# Altium project ProyectoMulticapa.PrjPcb (part 1 of 3)
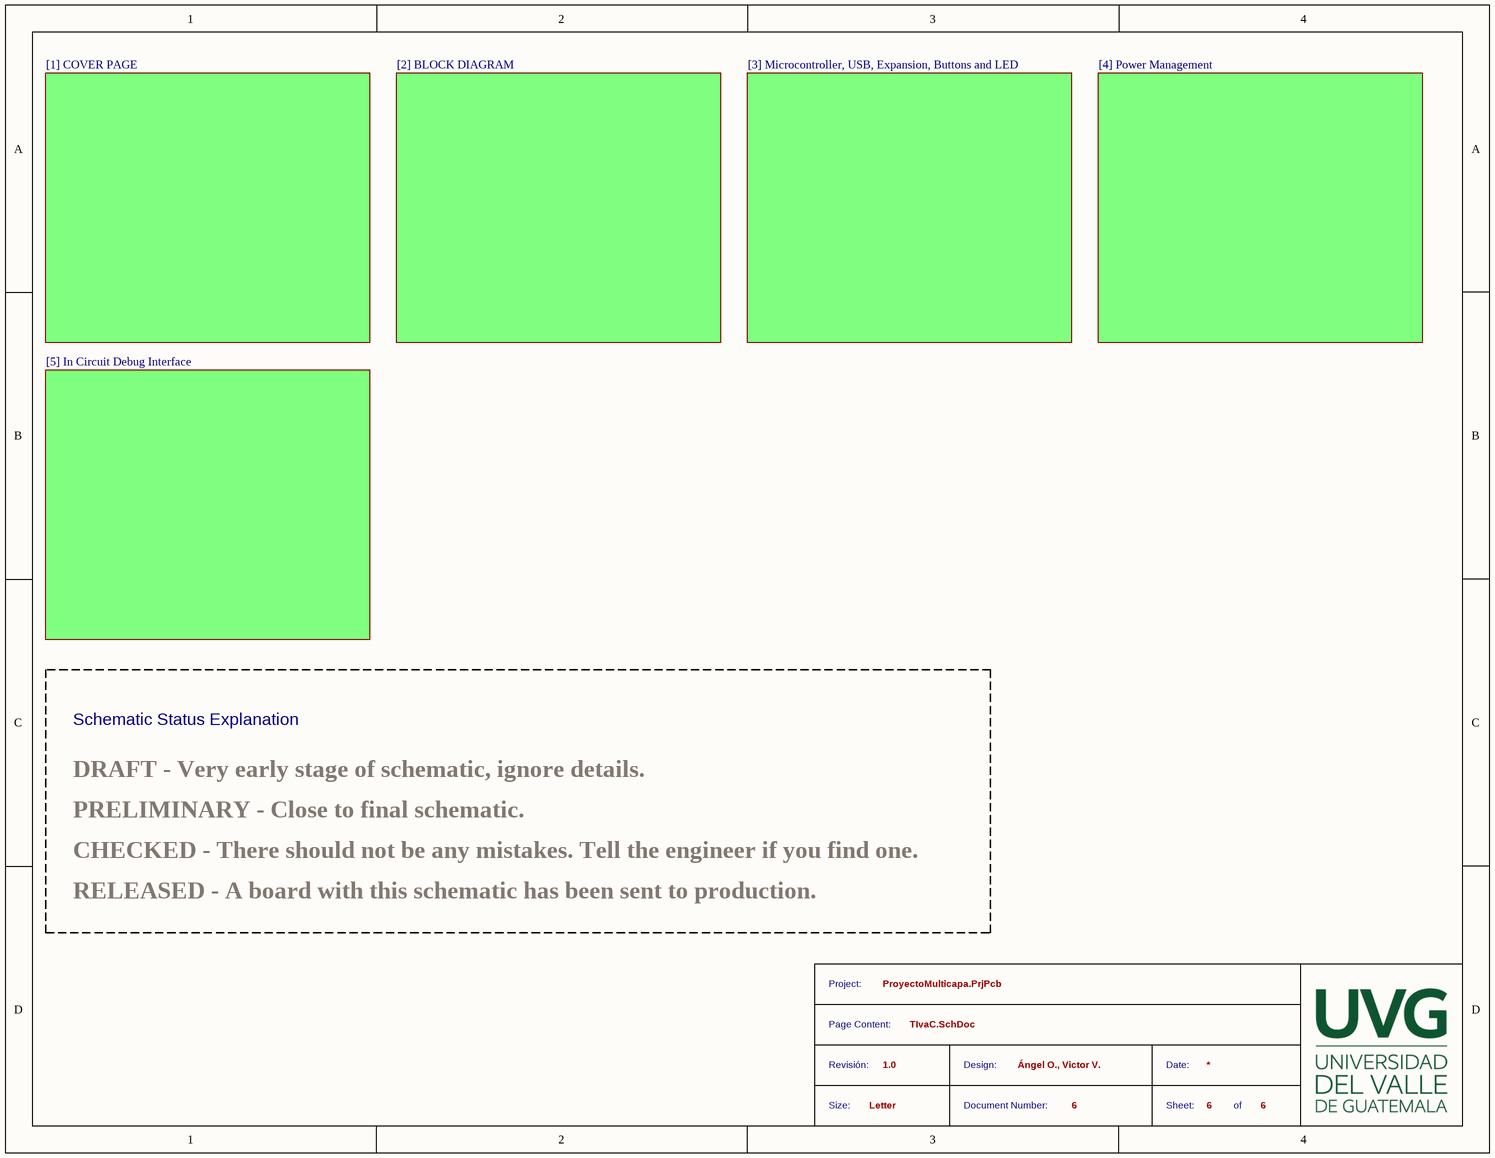
[diagram p0: TIvaC.SchDoc]
6 sheets, 98 parts. Net scope: global (net labels, ports and power ports of the same name join across sheets).
Board file: TivaC.PcbDoc
Sheets:
  TIvaC.SchDoc
    Designator = [1] COVER PAGE.SchDoc
    Designator = [2] BLOCK DIAGRAM.SchDoc
    Designator = [3] Microcontroller, USB, Expansion, Buttons and LED.SchDoc
    Designator = [4] Power Management.SchDoc
    Designator = [5] In Circuit Debug Interface.SchDoc

## Sheet TIvaC.SchDoc
size Letter; Author: Ángel O., Victor V.; DocumentNumber: 6; Revision: 1.0; SheetNumber: 6; SheetTotal: 6

### Sub-sheets
Designator = [1] COVER PAGE: no entries
Designator = [2] BLOCK DIAGRAM: no entries
Designator = [3] Microcontroller, USB, Expansion, Buttons and LED: no entries
Designator = [4] Power Management: no entries
Designator = [5] In Circuit Debug Interface: no entries

### Notes on the sheet
- Schematic Status Explanation
- PRELIMINARY - Close to final schematic.
- DRAFT - Very early stage of schematic, ignore details.
- RELEASED - A board with this schematic has been sent to production.
- CHECKED - There should not be any mistakes. Tell the engineer if you find one.
- Project:
- Page Content:
- Revisión:
- Size:
- Letter
- Design:
- Document Number:
- Date:
- Sheet:
- of

## Sheet [1] COVER PAGE.SchDoc
size Letter; Author: Ángel O. , Victor V.; DocumentNumber: 1; Revision: 1.0; SheetNumber: 1; SheetTotal: 6
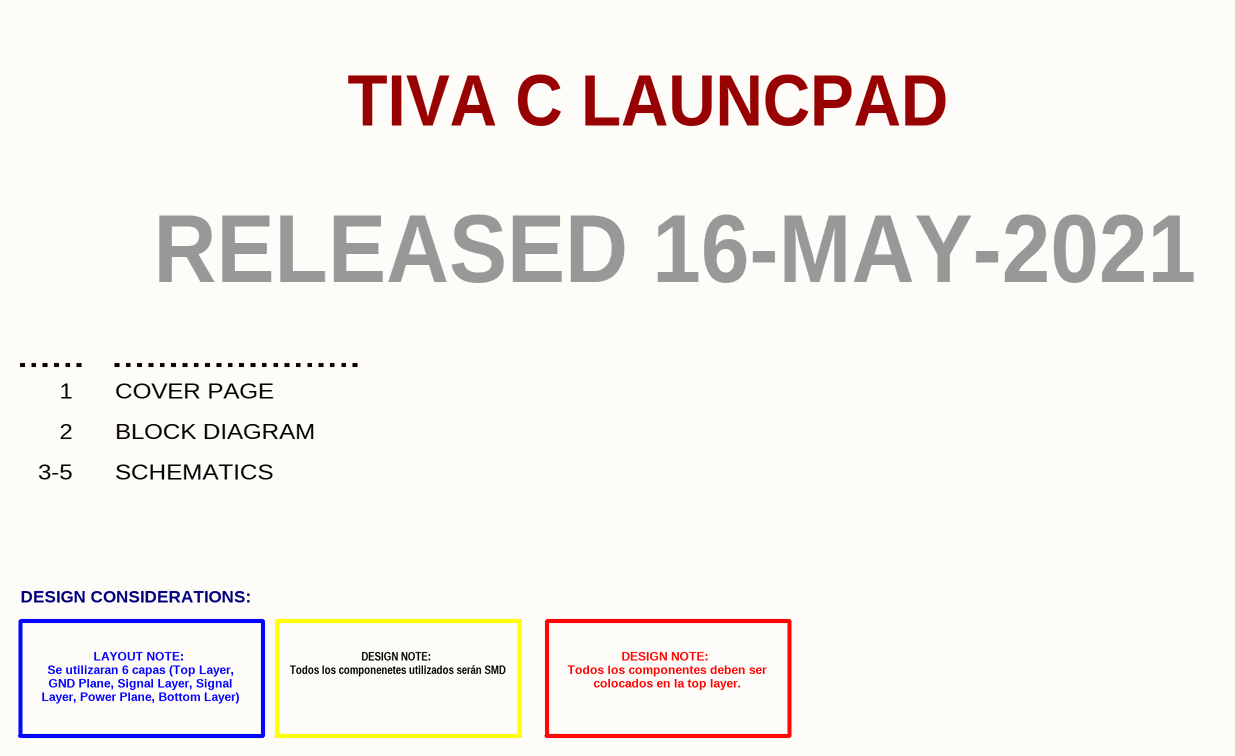
[diagram p1: [1] COVER PAGE.SchDoc]

### Notes on the sheet
- TIVA C LAUNCPAD
- RELEASED 16-MAY-2021
- 1
- COVER PAGE
- 2
- 3-5
- BLOCK DIAGRAM
- SCHEMATICS
- DESIGN CONSIDERATIONS:
- DESIGN NOTE:
  Todos los componenetes utilizados serán SMD
- DESIGN NOTE:
  Todos los componentes deben ser colocados en la top layer.
- LAYOUT NOTE:
  Se utilizaran 6 capas (Top Layer, GND Plane, Signal Layer, Signal Layer, Power Plane, Bottom Layer)
- Project:
- Page Content:
- Revisión:
- Size:
- Letter
- Design:
- Document Number:
- Date:
- Sheet:
- of

## Sheet [2] BLOCK DIAGRAM.SchDoc
size Letter; Author: Ángel O. , Victor V.; DocumentNumber: 2; Revision: 1.0; SheetNumber: 2; SheetTotal: 6
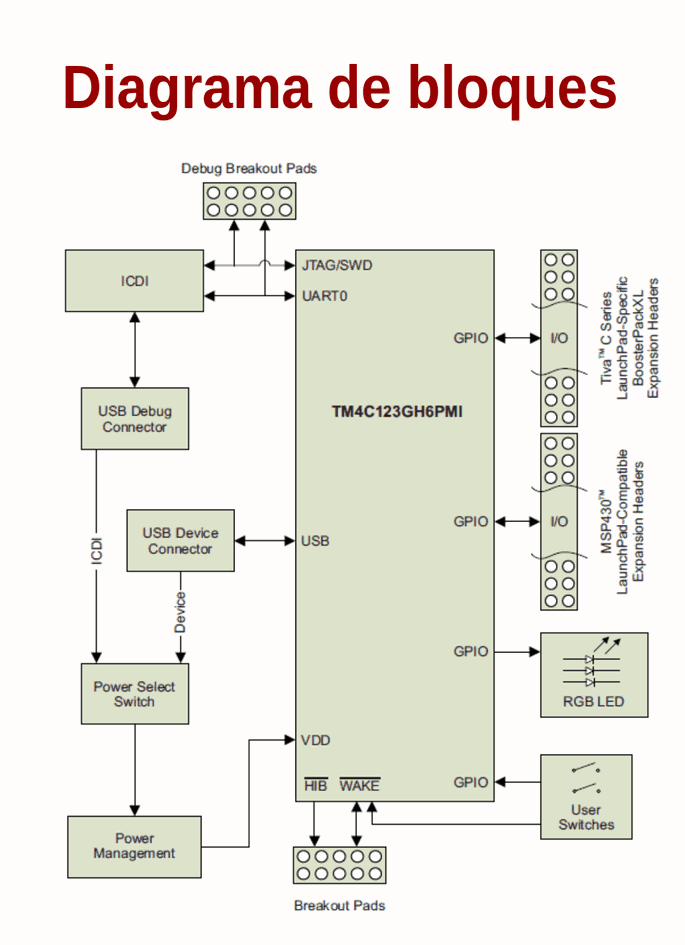
[diagram p2: [2] BLOCK DIAGRAM.SchDoc]

### Notes on the sheet
- Diagrama de bloques
- Project:
- Page Content:
- Revisión:
- Size:
- Letter
- Design:
- Document Number:
- Date:
- Sheet:
- of

## Sheet [3] Microcontroller, USB, Expansion, Buttons and LED.SchDoc
size Letter; Author: Ángel o., Victor V.; DocumentNumber: 3; Revision: 1.0; SheetNumber: 3; SheetTotal: 6
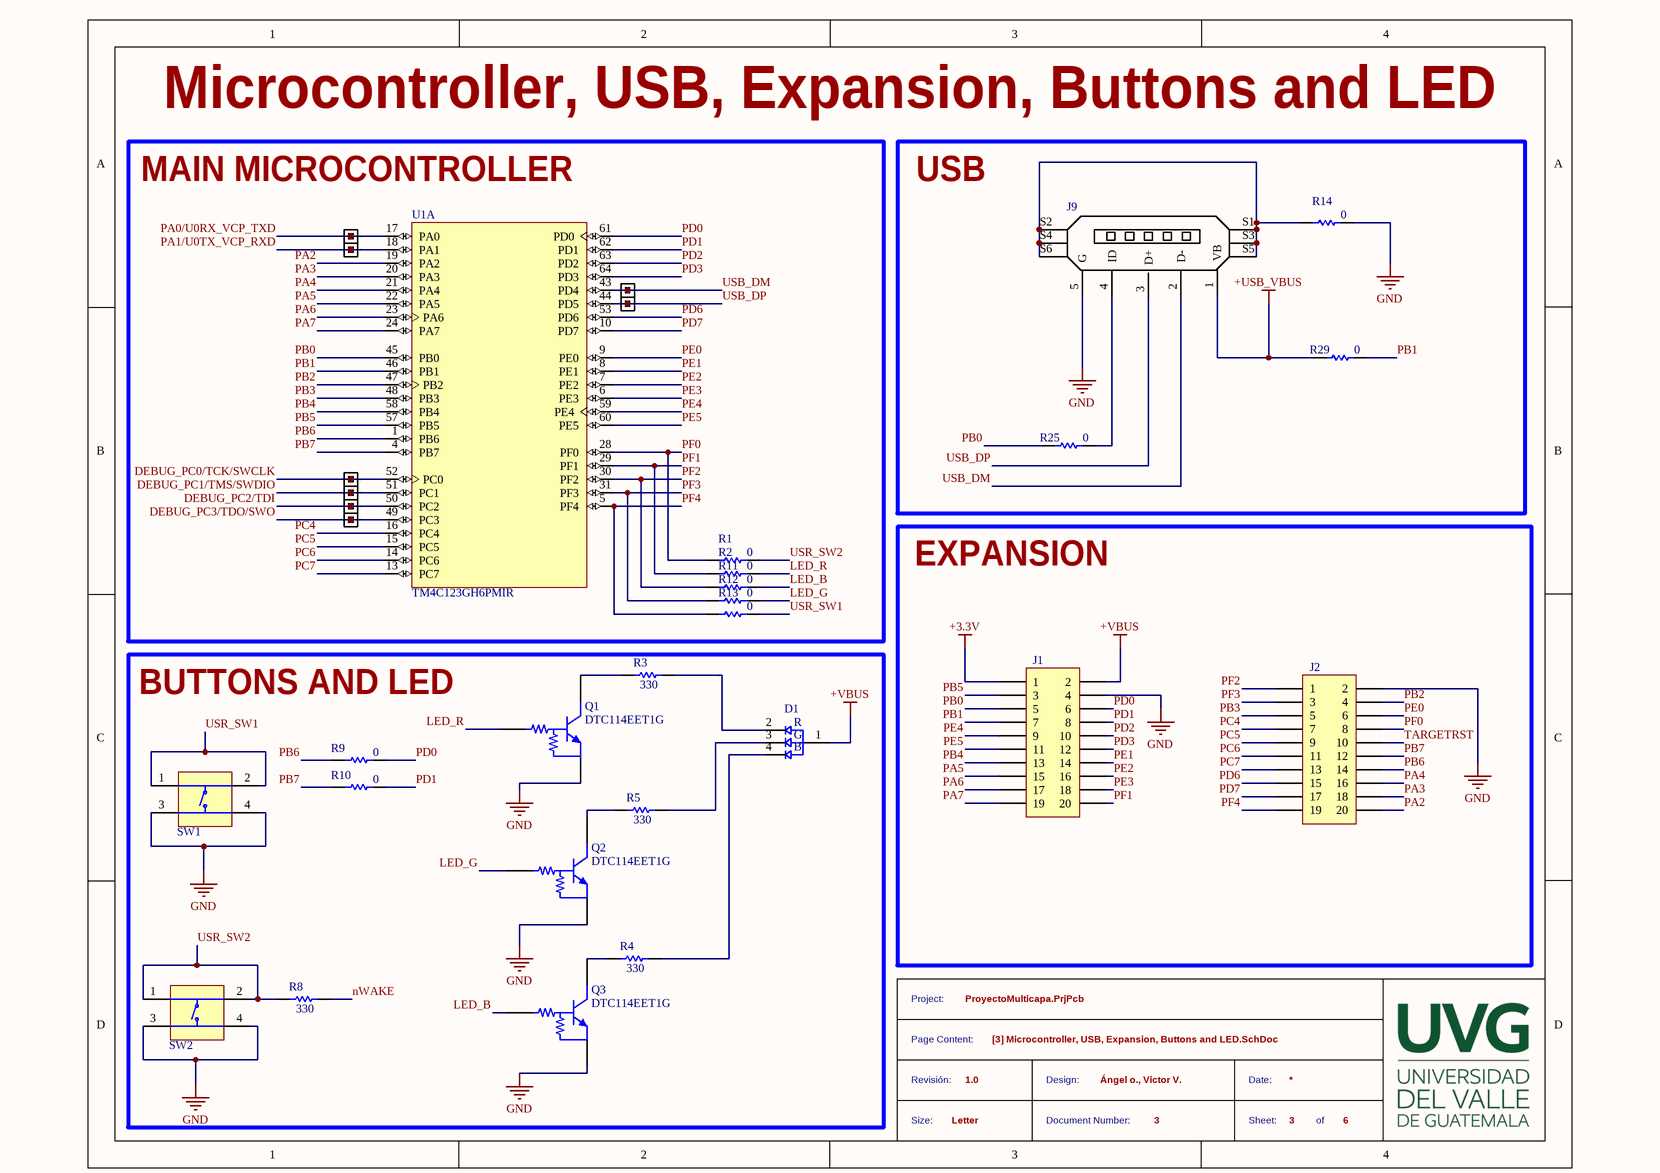
[diagram p3: [3] Microcontroller, USB, Expansion, Buttons and LED.SchDoc]

### Parts
D1  RSGHBHC1  [RGB LED]  (value not drawn)
J1  Header 20  [HDR2X10]  (value not drawn)
J2  Header 20  [HDR2X10]  (value not drawn)
J9  ZX62-B-5PA  [ZX62B5PA]  (value not drawn)
P1  header  [HEADER 1]  (value not drawn)
P2  header  [HEADER 1]  (value not drawn)
P3  header  [HEADER 1]  (value not drawn)
P4  header  [HEADER 1]  (value not drawn)
P5  header  [HEADER 1]  (value not drawn)
P6  header  [HEADER 1]  (value not drawn)
P7  header  [HEADER 1]  (value not drawn)
P8  header  [HEADER 1]  (value not drawn)
Q1  DTC114EET1G  [ONSC-SC-75-3-463-01_V]
Q2  DTC114EET1G  [ONSC-SC-75-3-463-01_V]
Q3  DTC114EET1G  [ONSC-SC-75-3-463-01_V]
R1  ERJ-3GEY0R00V  [FP-ERJ-3GEY0R00V-IPC_A]  (value not drawn)
R2  ERJ-3GEY0R00V  [FP-ERJ-3GEY0R00V-IPC_A]  (value not drawn)
R3  RC0402FR-07330RL  [RESC1005X40X25LL05T10]  (value not drawn)
R4  RC0402FR-07330RL  [RESC1005X40X25LL05T10]  (value not drawn)
R5  RC0402FR-07330RL  [RESC1005X40X25LL05T10]  (value not drawn)
R8  RC0402FR-07330RL  [RESC1005X40X25LL05T10]  (value not drawn)
R9  ERJ-3GEY0R00V  [FP-ERJ-3GEY0R00V-IPC_A]  (value not drawn)
R10  ERJ-3GEY0R00V  [FP-ERJ-3GEY0R00V-IPC_A]  (value not drawn)
R11  ERJ-3GEY0R00V  [FP-ERJ-3GEY0R00V-IPC_A]  (value not drawn)
R12  ERJ-3GEY0R00V  [FP-ERJ-3GEY0R00V-IPC_A]  (value not drawn)
R13  ERJ-3GEY0R00V  [FP-ERJ-3GEY0R00V-IPC_A]  (value not drawn)
R14  ERJ-3GEY0R00V  [FP-ERJ-3GEY0R00V-IPC_A]  (value not drawn)
R25  ERJ-3GEY0R00V  [FP-ERJ-3GEY0R00V-IPC_A]  (value not drawn)
R29  ERJ-3GEY0R00V  [FP-ERJ-3GEY0R00V-IPC_A]  (value not drawn)
SW1  B3S-1000  [OMRON-B3S-1000-4_V]  (value not drawn)
SW2  B3S-1000  [OMRON-B3S-1000-4_V]  (value not drawn)
U1  TM4C123GH6PMIR  [PM0064A_L]  (part A of 3)

### Blocks framed on the sheet
MAIN MICROCONTROLLER: P1-P8 R1 R2 R11-R13 U1
USB: J9 R14 R25 R29
EXPANSION: J1 J2
BUTTONS AND LED: D1 Q1-Q3 R3-R5 R8-R10 SW1 SW2

### Nets
+3.3V: J1.1
+USB_VBUS: J9.1(VB) R29.1
+VBUS: D1.1(A) J1.2
GND: J1.4 J2.2 J9.5(G) Q1.2(E) Q2.2(E) Q3.2(E) R14.2 SW1.3 SW1.4 SW2.3 SW2.4
DEBUG_PC0/TCK/SWCLK: P3.1 U1.52(PC0)
DEBUG_PC1/TMS/SWDIO: P4.1 U1.51(PC1)
DEBUG_PC2/TDI: P5.1 U1.50(PC2)
DEBUG_PC3/TDO/SWO: P6.1 U1.49(PC3)
LED_B: Q3.1(B) R11.2
LED_G: Q2.1(B) R12.2
LED_R: Q1.1(B) R2.2
nWAKE: R8.2
PA0/U0RX_VCP_TXD: P1.1 U1.17(PA0)
PA1/U0TX_VCP_RXD: P2.1 U1.18(PA1)
PA2: J2.20 U1.19(PA2)
PA3: J2.18 U1.20(PA3)
PA4: J2.16 U1.21(PA4)
PA5: J1.15 U1.22(PA5)
PA6: J1.17 U1.23(PA6)
PA7: J1.19 U1.24(PA7)
PB0: J1.5 R25.1 U1.45(PB0)
PB1: J1.7 R29.2 U1.46(PB1)
PB2: J2.4 U1.47(PB2)
PB3: J2.5 U1.48(PB3)
PB4: J1.13 U1.58(PB4)
PB5: J1.3 U1.57(PB5)
PB6: J2.14 R9.1 U1.1(PB6)
PB7: J2.12 R10.1 U1.4(PB7)
PC4: J2.7 U1.16(PC4)
PC5: J2.9 U1.15(PC5)
PC6: J2.11 U1.14(PC6)
PC7: J2.13 U1.13(PC7)
PD0: J1.6 R9.2 U1.61(PD0)
PD1: J1.8 R10.2 U1.62(PD1)
PD2: J1.10 U1.63(PD2)
PD3: J1.12 U1.64(PD3)
PD6: J2.15 U1.53(PD6)
PD7: J2.17 U1.10(PD7)
PE0: J2.6 U1.9(PE0)
PE1: J1.14 U1.8(PE1)
PE2: J1.16 U1.7(PE2)
PE3: J1.18 U1.6(PE3)
PE4: J1.9 U1.59(PE4)
PE5: J1.11 U1.60(PE5)
PF0: J2.8 R1.1 U1.28(PF0)
PF1: J1.20 R2.1 U1.29(PF1)
PF2: J2.1 R11.1 U1.30(PF2)
PF3: J2.3 R12.1 U1.31(PF3)
PF4: J2.19 R13.1 U1.5(PF4)
TARGETRST: J2.10
USB_DM: J9.2(D-) P7.1 U1.43(PD4)
USB_DP: J9.3(D+) P8.1 U1.44(PD5)
USR_SW1: R13.2 SW1.1 SW1.2
USR_SW2: R1.2 R8.1 SW2.1 SW2.2
NetD1_2: D1.2(R) R3.2
NetD1_3: D1.3(G) R5.2
NetD1_4: D1.4(B) R4.2
NetJ9_4: J9.4(ID) R25.2
NetJ9_S1: J9.S1 J9.S2 J9.S3 J9.S4 J9.S5 J9.S6 R14.1
NetQ1_3: Q1.3(C) R3.1
NetQ2_3: Q2.3(C) R5.1
NetQ3_3: Q3.3(C) R4.1

### Notes on the sheet
- Microcontroller, USB, Expansion, Buttons and LED
- Project:
- Page Content:
- Revisión:
- Size:
- Letter
- Design:
- Document Number:
- Date:
- Sheet:
- of
- (in symbol ERJ-3GEY0R00V) 0
- (in symbol RC0402FR-07330RL) 330

### Library data of the parts
D1 = RSGHBHC1: RGB LED; Manufacturer_Name: ROHM Semiconductor; Manufacturer_Part_Number: SMLP34RGB2W3; Manufacturer: Everlight; Manufacturer Part Number: 18-038/RSGHBHC1-S03/2T; Color: Blue,Green,Red; Lens Style: Clear; Forward Voltage: 3.3V; Datasheet Link: https://datasheet.lcsc.com/lcsc/1811021521_Everlight-Elec-18-038BT-BDGAR6S1-S06-10T_C142314.pdf; Height: 0.25mm; Mouser Part Number: 755-SMLP34RGB2W3; LCSC Price/Stock: https://lcsc.com/product-detail/Light-Emitting-Diodes-LED_RGB_C142314.html; RS Part Number: 1246883P; Price: 0.08; Supplier 1: Avnet; Stock 1: 0; RoHS: No; Lead Free: Lead Free; ComponentLink1URL: http://www.everlight.com/datasheets/18-038-RSGHBHC1-S01-2T.pdf?src-supplier=Avnet; ComponentLink1Description: http://www.everlight.com/datasheets/18-038-RSGHBHC1-S01-2T.pdf?src-supplier=Avnet; Supplier Part Number 1: 18-038/RSGHBHC1-S03-2T; RoHS Compliant: Yes
J1 J2 = SSW-110-23-S-D: Conn Socket Strip SKT 20 POS 2.54mm Solder ST Thru-Hole; Manufacturer: Samtec; Number of Contacts: 20; Gender: Female; Supplier 1: Mouser; Manufacturer Part Number: SSW-110-23-S-D; Stock 1: 82; Pricing 1: 1 = 5.20000, 10 = 4.99000, 50 = 4.99000, 100 = 4.16000, 1000 = 3.01000, 10000 = 2.76000 (USD); RoHS: Yes; Mount: Through Hole; Contact Plating: Gold; Number of Rows: 2; Packaging: Bulk; Termination: Solder; Pitch: 2.54mm; Radiation Hardening: No; RoHS Compliant: Yes; ComponentLink1URL: ftp://ftp.samtec.com/webfiles/PDF/SSQ_TH.PDF?src-supplier=Avnet; ComponentLink1Description: ftp://ftp.samtec.com/webfiles/PDF/SSQ_TH.PDF?src-supplier=Avnet
J9 = ZX62-B-5PA: USB Connectors MICRO B RECEPT RA SMT BTTM MNT; Manufacturer: Hirose; Manufacturer Part Number: ZX62-B-5PA(11); Number of Terminals/Pins: 5; Connector Type: USB,Receptacle; Gender: Receptacle; Current Rating: 1A; Mating Cycles: 10000; Voltage Rating: 30V; Number of Ports: 1; USB Standard: USB 2.0; Pitch: 0.65mm; Supplier 1: Farnell; Stock 1: 0; Pricing 1: 10 = 0.60800, 50 = 0.48000, 100 = 0.44900, 250 = 0.43000, 500 = 0.39100, 1000 = 0.35900 (GBP); RoHS: Yes; Mount: Surface Mount,Horizontal; Contact Plating: Gold; Contact Material: Copper Alloy; Min Operating Temperature: -30°C; Max Operating Temperature: 85°C; Packaging: Tape and Reel; Number of Contacts: 5; Package Quantity: 3500; Series: ZX62; Termination: Solder; Orientation: Right Angle; Number of Positions: 5; Max Voltage Rating (AC): 30V; Voltage Rating (AC): 30V; Length: 7.9mm; Depth: 5.6mm; Radiation Hardening: No; RoHS Compliant: Yes; REACH SVHC: No SVHC; Lead Free: Lead Free; Flammability Rating: UL94 V-0; ComponentLink1URL: https://datasheet.ciiva.com/11731/0900766b80d9c4df-11731324.pdf?src-supplier=RSComponents; ComponentLink1Description: https://datasheet.ciiva.com/11731/0900766b80d9c4df-11731324.pdf?src-supplier=RSComponents; ComponentLink2URL: https://datasheet.ciiva.com/15181/getdatasheetpartid-449685-15181366.pdf?src-supplier=Verical; ComponentLink2Description: https://datasheet.ciiva.com/15181/getdatasheetpartid-449685-15181366.pdf?src-supplier=Verical; ComponentLink3URL: https://datasheet.ciiva.com/7646/81390-7646778.pdf?src-supplier=Element14; ComponentLink3Description: https://datasheet.ciiva.com/7646/81390-7646778.pdf?src-supplier=Element14; Supplier 2: Mouser; Stock 2: 45031; Pricing 2: 1 = 0.61000, 10 = 0.57200, 50 = 0.57200, 100 = 0.46800, 1000 = 0.37700, 10000 = 0.33800 (USD); ComponentLink4URL: http://www.farnell.com/datasheets/2691174.pdf?src-supplier=Farnell; ComponentLink4Description: http://www.farnell.com/datasheets/2691174.pdf?src-supplier=Farnell; ComponentLink5URL: https://www.hirose.com/product/en/download_file/key_name/ZX62-B-5PA%2833%29/category/Specification%20Sheet/doc_file_id/87473/?file_category_id=9&item_id=02420033833&is_series=&src-supplier=Digi-Key; ComponentLink5Description: https://www.hirose.com/product/en/download_file/key_name/ZX62-B-5PA%2833%29/category/Specification%20Sheet/doc_file_id/87473/?file_category_id=9&item_id=02420033833&is_series=&src-supplier=Digi-Key; ComponentLink6URL: http://www.farnell.com/datasheets/2691174.pdf?src-supplier=Newark; ComponentLink6Description: http://www.farnell.com/datasheets/2691174.pdf?src-supplier=Newark; ComponentLink7URL: http://www.farnell.com/datasheets/2691174.pdf?src-supplier=Element14; ComponentLink7Description: http://www.farnell.com/datasheets/2691174.pdf?src-supplier=Element14; ComponentLink8URL: http://www.farnell.com/datasheets/2060515.pdf?src-supplier=Element14; ComponentLink8Description: http://www.farnell.com/datasheets/2060515.pdf?src-supplier=Element14; Supplier Part Number 1: 1645325; Supplier Part Number 2: 798-ZX62-B-5PA33
Q1-Q3 = DTC114EET1G: Trans Digital BJT NPN 50V 100mA 3-Pin SOT-416 T/R; Manufacturer: ON Semiconductor; Element Configuration: Single; hFE Min: 35; Max Power Dissipation: 200mW; Collector-emitter Voltage-Max: 250mV; Current Rating: 70mA; Output Voltage: 300mV; Supplier 1: Mouser; Manufacturer Part Number: DTC114EET1G; Stock 1: 385; Pricing 1: 1 = 0.16000, 10 = 0.14800, 50 = 0.14800, 100 = 0.08100, 1000 = 0.03400, 10000 = 0.02200 (USD); RoHS: Yes; Case/Package: SOT-416; Number of Pins: 3; Contact Plating: Tin,Matte; Min Operating Temperature: -55°C; Max Operating Temperature: 150°C; Collector Emitter Voltage (VCEO): 50V; Package Quantity: 1; Packaging: Tape and Reel; Max Collector Current: 100mA; Collector Emitter Breakdown Voltage: 50V; Polarity: NPN; Series: -; Max Output Current: 100mA; Operating Supply Voltage: 50V; Max Breakdown Voltage: 50V; Continuous Collector Current: 100mA; Collector Emitter Saturation Voltage: 250mV; Voltage Rating (DC): 50V; Length: 1.6mm; Width: 0.8mm; Height: 0.75mm; Radiation Hardening: No; RoHS Compliant: Yes; Lead Free: Lead Free; Halogen Free: Halogen Free; REACH SVHC: No SVHC; ComponentLink1URL: https://datasheet.ciiva.com/15139/getdatasheetpartid-32044-15139553.pdf?src-supplier=Verical; ComponentLink1Description: https://datasheet.ciiva.com/15139/getdatasheetpartid-32044-15139553.pdf?src-supplier=Verical; ComponentLink2URL: https://datasheet.ciiva.com/989/dtc114e-d-989078.pdf?src-supplier=Digi-Key; ComponentLink2Description: https://datasheet.ciiva.com/989/dtc114e-d-989078.pdf?src-supplier=Digi-Key; ComponentLink3URL: https://datasheet.ciiva.com/989/dtc114e-d-989079.pdf?src-supplier=Digi-Key; ComponentLink3Description: https://datasheet.ciiva.com/989/dtc114e-d-989079.pdf?src-supplier=Digi-Key; ComponentLink4URL: https://datasheet.ciiva.com/989/dtc114e-d-989080.pdf?src-supplier=Digi-Key; ComponentLink4Description: https://datasheet.ciiva.com/989/dtc114e-d-989080.pdf?src-supplier=Digi-Key; ComponentLink5URL: https://datasheet.ciiva.com/11210/dtc124e-d-11210255.pdf?src-supplier=Avnet; ComponentLink5Description: https://datasheet.ciiva.com/11210/dtc124e-d-11210255.pdf?src-supplier=Avnet; ComponentLink6URL: https://datasheet.ciiva.com/16349/dtc114e-d-16349642.pdf?src-supplier=Future+Electronics; ComponentLink6Description: https://datasheet.ciiva.com/16349/dtc114e-d-16349642.pdf?src-supplier=Future+Electronics; ComponentLink7URL: https://datasheet.ciiva.com/22661/1813827-22661178.pdf?src-supplier=Element14; ComponentLink7Description: https://datasheet.ciiva.com/22661/1813827-22661178.pdf?src-supplier=Element14; Supplier Part Number 1: 863-DTC114EET1G
R1 R2 R9-R14 R25 R29 = ERJ-3GEY0R00V: Res Thick Film 0603 0 Ohm Jumper Molded SMD Punched Carrier T/R; Manufacturer: Panasonic; Resistance: 0R; Power Rating: 100mW; Voltage Rating: 75V; Tolerance: 0%; Temperature Coefficient: 600ppm/°C; Voltage Rating (DC): 50V; Supplier 1: Future Electronics; Manufacturer Part Number: ERJ-3GEY0R00V; Stock 1: 910317; Pricing 1: 1 = 0.01920, 50 = 0.01640, 100 = 0.01600, 500 = 0.01500, 1500 = 0.01440 (USD); RoHS: Yes; Mount: Surface Mount; Case/Package: 0603; Contact Plating: Tin; Case Code (Metric): 1608; Case Code (Imperial): 0603; Size Code: 0603; Min Operating Temperature: -55°C; Max Operating Temperature: 155°C; Resistor Type: Thick Film; Packaging: Tape and Reel; Package Quantity: 1; Number of Terminations: 2; Termination: SMD/SMT; Max Power Dissipation: 100mW; Features: Automotive AEC-Q200; Series: ERJ; Construction: Rectangular; Technology: THICK FILM; Length: 1.6mm; Width: 0.031inch; Height: 0.45mm; Depth: 0.8mm; Radiation Hardening: No; REACH SVHC: No SVHC; Military Standard: Not; Lead Free: Lead Free; RoHS Compliant: Yes; ComponentLink1URL: https://datasheet.ciiva.com/11808/0900766b80f806dd-11808207.pdf?src-supplier=RSComponents; ComponentLink1Description: https://datasheet.ciiva.com/11808/0900766b80f806dd-11808207.pdf?src-supplier=RSComponents; ComponentLink2URL: https://datasheet.ciiva.com/27055/1935748-27055113.pdf?src-supplier=Jameco; ComponentLink2Description: https://datasheet.ciiva.com/27055/1935748-27055113.pdf?src-supplier=Jameco; ComponentLink3URL: https://datasheet.ciiva.com/48532/aoa0000ce1-48532165.pdf?src-supplier=Avnet; ComponentLink3Description: https://datasheet.ciiva.com/48532/aoa0000ce1-48532165.pdf?src-supplier=Avnet; ComponentLink4URL: https://datasheet.ciiva.com/5959/1678796-5959707.pdf?src-supplier=Farnell; ComponentLink4Description: https://datasheet.ciiva.com/5959/1678796-5959707.pdf?src-supplier=Farnell; ComponentLink5URL: https://datasheet.ciiva.com/43460/1678796-43460647.pdf?src-supplier=Farnell; ComponentLink5Description: https://datasheet.ciiva.com/43460/1678796-43460647.pdf?src-supplier=Farnell; ComponentLink6URL: https://datasheet.ciiva.com/9198/aoa0000ce1-9198975.pdf?src-supplier=Avnet; ComponentLink6Description: https://datasheet.ciiva.com/9198/aoa0000ce1-9198975.pdf?src-supplier=Avnet; ComponentLink7URL: https://datasheet.ciiva.com/30199/4aoa0000ce1-30199822.pdf?src-supplier=Onlinecomponents.com; ComponentLink7Description: https://datasheet.ciiva.com/30199/4aoa0000ce1-30199822.pdf?src-supplier=Onlinecomponents.com; ComponentLink8URL: https://datasheet.ciiva.com/16758/70255313-16758527.pdf?src-supplier=Allied+Electronics; ComponentLink8Description: https://datasheet.ciiva.com/16758/70255313-16758527.pdf?src-supplier=Allied+Electronics; ComponentLink9URL: https://datasheet.ciiva.com/16834/aoa0000ce1-16834828.pdf?src-supplier=Future+Electronics; ComponentLink9Description: https://datasheet.ciiva.com/16834/aoa0000ce1-16834828.pdf?src-supplier=Future+Electronics; ComponentLink10URL: https://datasheet.ciiva.com/46377/1678796-46377868.pdf?src-supplier=Element14; ComponentLink10Description: https://datasheet.ciiva.com/46377/1678796-46377868.pdf?src-supplier=Element14; ComponentLink11URL: https://datasheet.ciiva.com/28695/1678796-28695833.pdf?src-supplier=Element14; ComponentLink11Description: https://datasheet.ciiva.com/28695/1678796-28695833.pdf?src-supplier=Element14; ComponentLink12URL: https://datasheet.ciiva.com/17215/aoa0000ce1-17215388.pdf?src-supplier=Avnet+Europe; ComponentLink12Description: https://datasheet.ciiva.com/17215/aoa0000ce1-17215388.pdf?src-supplier=Avnet+Europe; Supplier Part Number 1: 4103908
R3-R5 R8 = RC0402FR-07330RL: Res Thick Film 0402 330 Ohm 1% 0.063W(1/16W) ±100ppm/C Pad SMD T/R; Manufacturer: Yageo / Phycomp; Resistance: 330R; Temperature Coefficient: 100ppm/°C; Power Rating: 62.5mW; Voltage Rating: 50V; Max Power Dissipation: 63mW; Part Number: RC0402FR-07330RL; Supplier 1: Future Electronics; Manufacturer Part Number: RC0402FR-07330RL; Stock 1: 814184; Pricing 1: 1 = 0.00590, 500 = 0.00300, 1500 = 0.00260, 2500 = 0.00250, 5000 = 0.00230 (USD); RoHS: Yes; Case/Package: 0402; Case Code (Metric): 1005; Case Code (Imperial): 0402; Size Code: 0402; Min Operating Temperature: -55°C; Max Operating Temperature: 155°C; Packaging: Tape and Reel; Tolerance: 1%; Package Quantity: 1; Resistor Type: Thick Film; Number of Terminations: 2; Termination: SMD/SMT; Features: Moisture Resistant; Series: RC; Construction: Rectangular; Technology: THICK FILM; Resistance Tolerance: 1%; Length: 0.039inch; Width: 0.02inch; Height: 0.016inch; Depth: 0.5mm; RoHS Compliant: Yes; REACH SVHC: Unknown; Military Standard: Not; Lead Free: Lead Free; ComponentLink1URL: https://datasheet.ciiva.com/11819/0900766b80c66297-11819490.pdf?src-supplier=RSComponents; ComponentLink1Description: https://datasheet.ciiva.com/11819/0900766b80c66297-11819490.pdf?src-supplier=RSComponents; ComponentLink2URL: https://datasheet.ciiva.com/12656/pyu-rc0402-51-rohs-l-6-r-12656815.pdf?src-supplier=Mouser; ComponentLink2Description: https://datasheet.ciiva.com/12656/pyu-rc0402-51-rohs-l-6-r-12656815.pdf?src-supplier=Mouser; ComponentLink3URL: https://datasheet.ciiva.com/2453/pyu-r-int-thick-7-2453661.pdf?src-supplier=Digi-Key; ComponentLink3Description: https://datasheet.ciiva.com/2453/pyu-r-int-thick-7-2453661.pdf?src-supplier=Digi-Key; ComponentLink4URL: https://datasheet.ciiva.com/2453/pyu-r-int-thick-7-2453662.pdf?src-supplier=Digi-Key; ComponentLink4Description: https://datasheet.ciiva.com/2453/pyu-r-int-thick-7-2453662.pdf?src-supplier=Digi-Key; ComponentLink5URL: https://datasheet.ciiva.com/2453/pyu-r-int-thick-7-2453663.pdf?src-supplier=Digi-Key; ComponentLink5Description: https://datasheet.ciiva.com/2453/pyu-r-int-thick-7-2453663.pdf?src-supplier=Digi-Key; ComponentLink6URL: https://datasheet.ciiva.com/7849/1018594-7849962.pdf?src-supplier=Element14; ComponentLink6Description: https://datasheet.ciiva.com/7849/1018594-7849962.pdf?src-supplier=Element14; ComponentLink7URL: https://datasheet.ciiva.com/7849/1018594-7849963.pdf?src-supplier=Element14; ComponentLink7Description: https://datasheet.ciiva.com/7849/1018594-7849963.pdf?src-supplier=Element14; ComponentLink8URL: https://datasheet.ciiva.com/17083/pyu-rc0402-51-rohs-l-6-r-17083994.pdf?src-supplier=Future+Electronics; ComponentLink8Description: https://datasheet.ciiva.com/17083/pyu-rc0402-51-rohs-l-6-r-17083994.pdf?src-supplier=Future+Electronics; Supplier Part Number 1: 6023220
SW1 SW2 = B3S-1000: Sealed Tactile Switch, SPST-NO, 3 to 24 V, -25 to 70 degC, 4-Pin SMD, RoHS, Bulk; Manufacturer: Omron; Voltage Rating: 24 V; Current Rating: 50 mA; Contact Plating: Silver; ComponentLink1Description: Manufacturer URL; Packaging: Bulk; Package Quantity: 1500; Min Operating Temperature: -25 degC; Max Operating Temperature: 70 degC; REACH SVHC: No SVHC; ComponentLink1URL: http://www.omron.com/; RoHSCompliant: true; PackageDescription: 4-Pin Surface Mount Device, Body 6.6 x 6 mm; ComponentLink2URL: http://www.omron.com/ecb/products/pdf/en-b3s.pdf; DatasheetVersion: 10/2014; Length: 6.6 mm; Height: 4.3 mm; ComponentLink2Description: Datasheet; Mount: Surface Mount; Mounting Technology: Surface Mount; PackageReference: B3S-1000
U1 = TM4C123GH6PMI: Tiva C Series Microcontroller, 256 KB Flash, 32 KB SRAM, 12 Bit, 12 Channels, -40 to 85 degC, 64-Pin LQFP (PM), Green (RoHS & no Sb/Br), Tape and Reel; Manufacturer: Texas Instruments; Data Memory: 32 KB; UART: 4; Max Speed: 80 MHz; I2C: 2; GPIOs: 43; ADC Channels: 12; Program Memory: 256 KB; ADC Resolution: 12 Bit; Tiva Series: Connected MCUs; Prefix: Qualified Device; Interface: I2C,USB,CAN,UART,SPI,IrDA,USART,I2S; Data Bus Width: 32b; Core Architecture: ARM; RAM Size: 32KB; Frequency: 80MHz; Oscillator Type: Internal; Number of Programmable I/O: 49; Watchdog Timer: Yes; Memory Size: 256KB; Peripherals: Brown-out Detect/Reset,POR,PWM,WDT,DMA; Max Supply Voltage: 3.63V; Min Supply Voltage: 3.15V; Operating Supply Voltage: 3.3V; ComponentLink2URL: http://www.ti.com/lit/ds/symlink/tm4c123gh6pm.pdf; Temperature Range: -40 to 85 degC; ComponentLink2Description: Datasheet; DatasheetVersion: Rev. 15741.2722; ComponentLink1URL: http://www.ti.com/; PackageVersion: 4040152/C; PartNumber: TM4C123GH6PMIR; Mounting Technology: Surface Mount; Packing: Tape and Reel; PackageDescription: 64-Pin Plastic Quad Flatpack, Body 10 x 10 mm, Pitch 0.5 mm; ComponentLink3Description: Package Specification; PackageReference: PM0064A; RoHS: TRUE; ComponentLink1Description: Manufacturer URL; ComponentLink3URL: http://www.ti.com/litv/pdf/mtqf008a; Supplier 1: Digi-Key; Manufacturer Part Number: TM4C123GH6PMIR; Stock 1: 2640; Pricing 1: 1 = 11.85000, 10 = 10.70700, 25 = 10.20880, 100 = 8.86440, 250 = 8.46600, 500 = 7.71900 (USD); Case/Package: LQFP; Number of Pins: 64; Min Operating Temperature: -40°C; Max Operating Temperature: 85°C; Packaging: Tape and Reel; Number of I/Os: 43; Number of Timers/Counters: 12; Number of ADC Channels: 12; Max Frequency: 80MHz; Memory Type: FLASH; Number of UART Channels: 4; Number of A/D Converters: 12; Number of GPIO: 43; Package Quantity: 1000; Number of Bits: 12; Radiation Hardening: No; Lead Free: Lead Free; RoHS Compliant: Yes; ComponentLink4URL: https://datasheet.ciiva.com/18628/tm4c123gh6pm-18628995.pdf?src-supplier=Digi-Key; ComponentLink4Description: https://datasheet.ciiva.com/18628/tm4c123gh6pm-18628995.pdf?src-supplier=Digi-Key; ComponentLink5URL: https://datasheet.ciiva.com/29986/tm4c123gh6pm-29986949.pdf?src-supplier=Avnet; ComponentLink5Description: https://datasheet.ciiva.com/29986/tm4c123gh6pm-29986949.pdf?src-supplier=Avnet; Supplier Part Number 1: 296-46360-1-ND